# Altium schematic sheet 说明.SchDoc
size A4
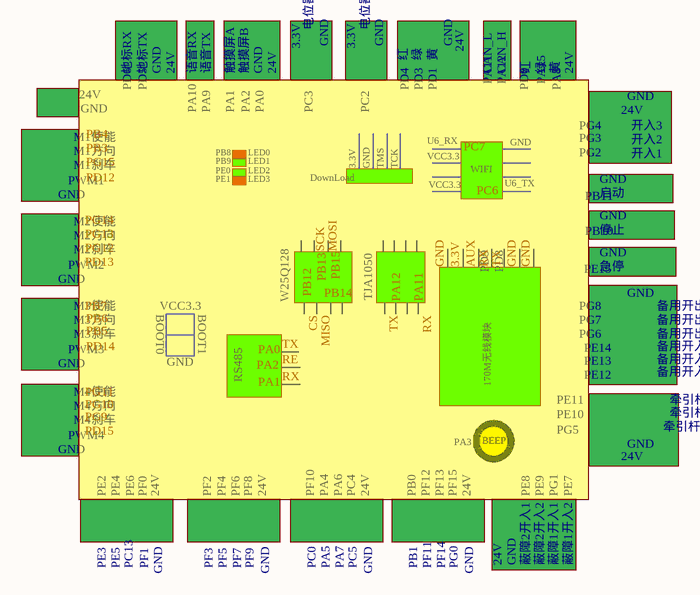
[diagram p0: 说明.SchDoc]

## Notes on the sheet
- 电位器1
- 电位器2
- 地标RX
- PD6
- 地标TX
- PD5
- GND
- 24V
- 语音RX
- 语音TX
- 触摸屏A
- 触摸屏B
- 3.3V
- 红
- PD4
- 绿
- PD3
- 黄
- PD1
- CAN_L
- PA11
- CAN_H
- PA12
- PD0
- PA15
- PA8
- M1使能
- M1方向
- PA10
- PA9
- PB8
- PB9
- PA1
- LED0
- LED1
- PA2
- PA0
- PC3
- DownLoad
- PC2
- TMS
- TCK
- U6_RX
- VCC3.3
- PG3
- PG4
- PG2
- 开入3
- 开入2
- 开入1
- PWM1
- M1刹车
- M2使能
- PE1
- PE0
- LED2
- LED3
- WIFI
- U6_TX
- PB11
- PB10
- 停止
- 启动
- PWM2
- M2方向
- M2刹车
- W25Q128
- TJA1050
- PD9
- PD8
- PE15
- 急停
- PWM3
- M3使能
- M3方向
- M3刹车
- BOOT0
- BOOT1
- PG6
- PG7
- PG8
- PE13
- PE14
- 备用开入1
- 备用开出1
- 备用开出2
- 备用开出3
- 备用开入2
- 备用开入3
- PWM4
- M4使能
- M4方向
- M4刹车
- RS485
- PA3
- BEEP
- 170M无线模块
- PG5
- PE10
- PE11
- PE12
- 牵引杆开出
- 牵引杆开入2
- 牵引杆开入1
- PE2
- PE4
- PE6
- PF0
- PF2
- PF4
- PF6
- PF8
- PF10
- PA4
- PA6
- PC4
- PB0
- PF12
- PF13
- PF15
- PE8
- PE9
- PG1
- PE7
- PE3
- PE5
- PC13
- PF1
- PF3
- PF5
- PF7
- PF9
- PC0
- PA5
- PA7
- PC5
- PB1
- PF11
- PF14
- PG0
- 蔽障2开入1
- 蔽障2开入2
- 蔽障1开入1
- 蔽障1开入2
- Labels drawn without touching a wire or pin: PA0, PA1, PA2, PA11, PA12, PB3, PB4, PB5, PB6, PB7, PB12, PB13, PB14, PB15, PC6, PC7, PD12, PD13, PD14, PD15, PG9, PG10, PG11, PG12, PG13, PG14, PG15